# EAGLE design IRComputer (EAGLE 7.3.0)
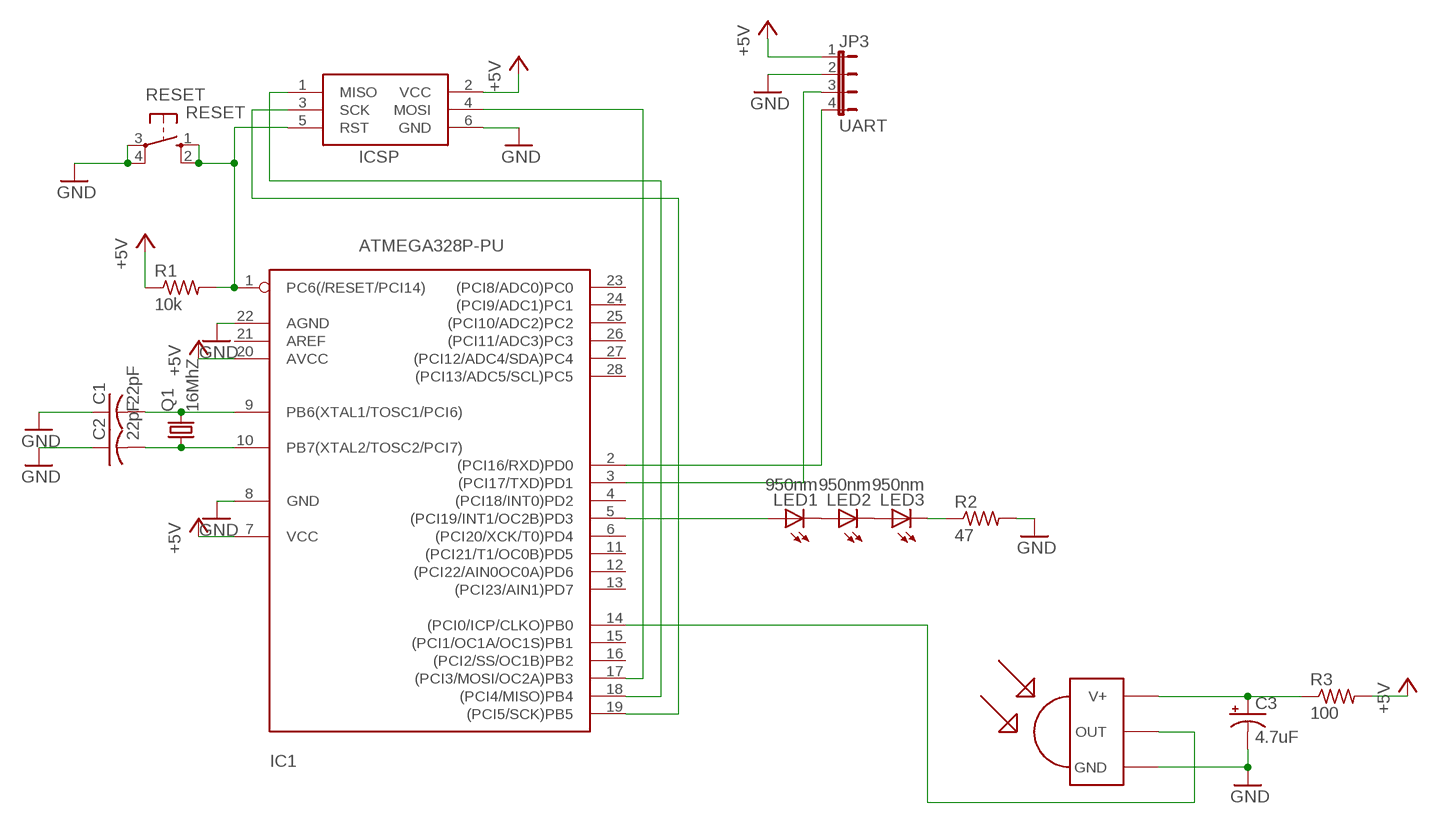
[diagram p0: schematic, sheet 1]

## Parts
C1  22pF  C-US025-024X044  [C025-024X044]
C2  22pF  C-US025-024X044  [C025-024X044]
C3  4.7uF  CPOL-USE1.8-4  [E1,8-4]
IC1  ATMEGA328P-PU  ATMEGA168-20P  [DIL28-3]
ICSP  AVRISP-6  [AVRISP]
JP3  UART  JP4E  [JP4]
LED1  950nm  LED5MM  [LED5MM]
LED2  950nm  LED5MM  [LED5MM]
LED3  950nm  LED5MM  [LED5MM]
Q1  16MhZ  CRYSTALHC49S  [HC49/S]
R1  10k  R-US_0204/7  [0204/7]
R2  47  R-US_0204/7  [0204/7]
R3  100  R-US_0204/7  [0204/7]
RESET  RESET  10-XX  [B3F-10XX]
U$1  TSOP1838  [TSOP18XX]

## Nets
+5V: IC1.7(VCC) IC1.20(AVCC) ICSP.2(VCC) JP3.1 R1.1 R3.2
GND [Ground]: C1.1 C2.1 C3.- IC1.8(GND) IC1.22(AGND) ICSP.6(GND) JP3.2 R2.2 RESET.3(P) RESET.4(P1) U$1.GND
N$1 [Oscillator]: C1.2 IC1.9(PB6(XTAL1/TOSC1/PCI6)) Q1.2
N$2 [Oscillator]: C2.2 IC1.10(PB7(XTAL2/TOSC2/PCI7)) Q1.1
N$3: IC1.14((PCI0/ICP/CLKO)PB0) U$1.OUT
N$4: C3.+ R3.1 U$1.VCC(V+)
N$5: IC1.3((PCI17/TXD)PD1) JP3.3
N$6: IC1.2((PCI16/RXD)PD0) JP3.4
N$7: IC1.5((PCI19/INT1/OC2B)PD3) LED1.A
N$8: IC1.17((PCI3/MOSI/OC2A)PB3) ICSP.4(MOSI)
N$9: IC1.18((PCI4/MISO)PB4) ICSP.1(MISO)
N$10: IC1.19((PCI5/SCK)PB5) ICSP.3(SCK)
N$11: LED2.K(C) LED3.A
N$12: LED3.K(C) R2.1
N$13: LED1.K(C) LED2.A
N$15: IC1.1(PC6(/RESET/PCI14)) ICSP.5(RST) R1.2 RESET.1(S) RESET.2(S1)
Unconnected: IC1.4((PCI18/INT0)PD2) IC1.6((PCI20/XCK/T0)PD4) IC1.11((PCI21/T1/OC0B)PD5) IC1.12((PCI22/AIN0OC0A)PD6) IC1.13((PCI23/AIN1)PD7) IC1.15((PCI1/OC1A/OC1S)PB1) IC1.16((PCI2/SS/OC1B)PB2) IC1.21(AREF) IC1.23((PCI8/ADC0)PC0) IC1.24((PCI9/ADC1)PC1) IC1.25((PCI10/ADC2)PC2) IC1.26((PCI11/ADC3)PC3) IC1.27((PCI12/ADC4/SDA)PC4) IC1.28((PCI13/ADC5/SCL)PC5)

## Library data of the parts
C1 C2 = adafruit:C-US: CAPACITOR, American symbol
C3 = adafruit:CPOL-US: POLARIZED CAPACITOR, American symbol
IC1 = adafruit:ATMEGA168*P: MICROCONTROLLER 16 kBytes FLASH 1 kBytes SRAM 512 Bytes EEPROM USART 8-channel 10 bit ADC
ICSP = adafruit:AVRISP: AVR ISP HEADER Standard 6 pin header for AVR programming
JP3 = jumper:JP4E: JUMPER
LED1-LED3 = adafruit:LED: LED OSRAM: - CHIPLED LG R971, LG N971, LY N971, LG Q971, LY Q971, LO R971, LY R971 LH N974, LH R974 LS Q976, LO Q976, LY Q976 LO Q996 - Hyper CHIPLED LW Q18S LB Q993, LB Q99A, LB R99A - SideLED LS A670, LO A670, LY A670, LG A670, LP A670 LB A673, LV A673, LT A673, LW A673 LH A674 LY A675 LS A676, LA A676, LO A676, LY A676, LW A676 LS A679, LY A679, LG A679 - Hyper Micro SIDELED® LS Y876, LA Y876, LO Y876, LY Y876 LT Y87S - SmartLED LW L88C, LW L88S LB L89C, LB L89S, LG L890 LS L89K, LO L89K, LY L89K LS L896, LA L896, LO L896, LY L896 - TOPLED LS T670, LO T670, LY T670, LG T670, LP T670 LSG T670, LSP T670, LSY T670, LOP T670, LYG T670 LG T671, LOG T671, LSG T671 LB T673, LV T673, LT T673, LW T673 LH T674 LS T676, LA T676, LO T676, LY T676, LB T676, LH T676, LSB T676, LW T676 LB T67C, LV T67C, LT T67C, LS T67K, LO T67K, LY T67K, LW E67C LS E67B, LA E67B, LO E67B, LY E67B, LB E67C, LV E67C, LT E67C LW T67C LS T679, LY T679, LG T679 LS T770, LO T770, LY T770, LG T770, LP T770 LB T773, LV T773, LT T773, LW T773 LH T774 LS E675, LA E675, LY E675, LS T675 LS T776, LA T776, LO T776, LY T776, LB T776 LHGB T686 LT T68C, LB T68C - Hyper Mini TOPLED® LB M676 - Mini TOPLED Santana® LG M470 LS M47K, LO M47K, LY M47K Source: http://www.osram.convergy.de/
Q1 = adafruit:CRYSTAL: CRYSTAL; OC_FARNELL: 1667008; OC_NEWARK: unknown
R1-R3 = adafruit:R-US_: RESISTOR, American symbol
RESET = switch-omron:10-XX: OMRON SWITCH; MPN: B3F-1000; OC_FARNELL: 176432; OC_NEWARK: 36M3542
U$1 = tsop:TSOP1838: IR Receiver and Demodulator

## Net classes
0 default: width 0.508 mm, drill 0.508 mm, clearance 0.152 mm
1 Oscillator: width 0.508 mm, drill 0.508 mm, clearance 0.152 mm
2 Ground: width 0.508 mm, drill 0.508 mm, clearance 0.254 mm

## Board
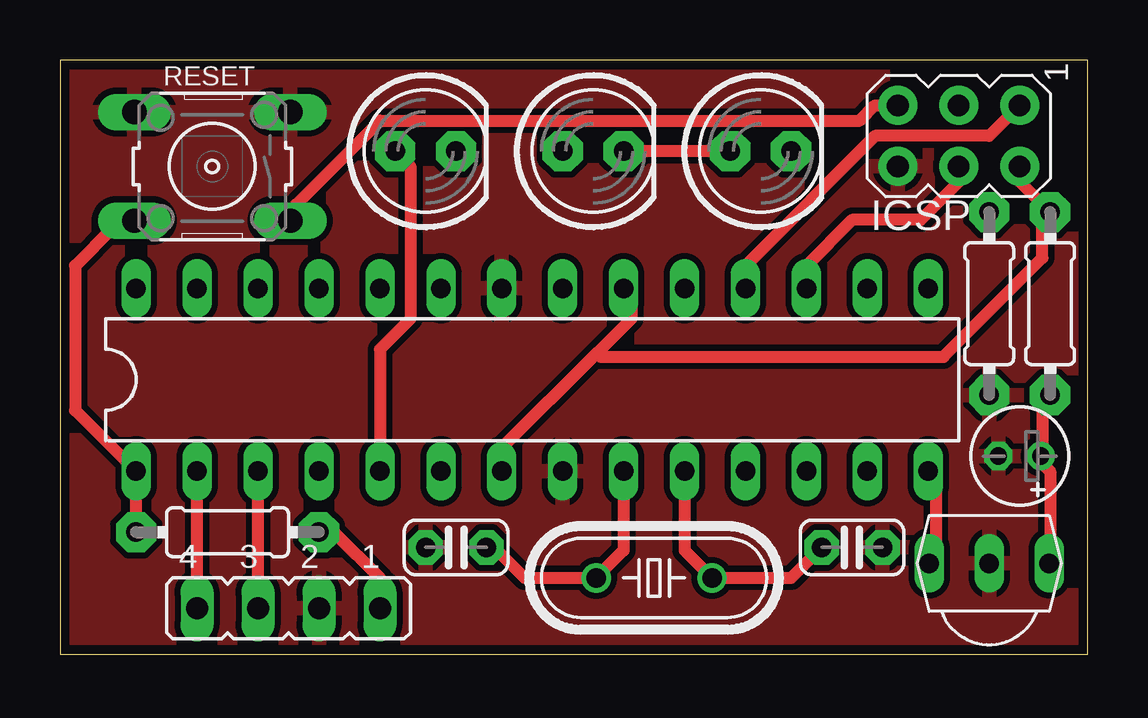
[diagram p1: board, top side]
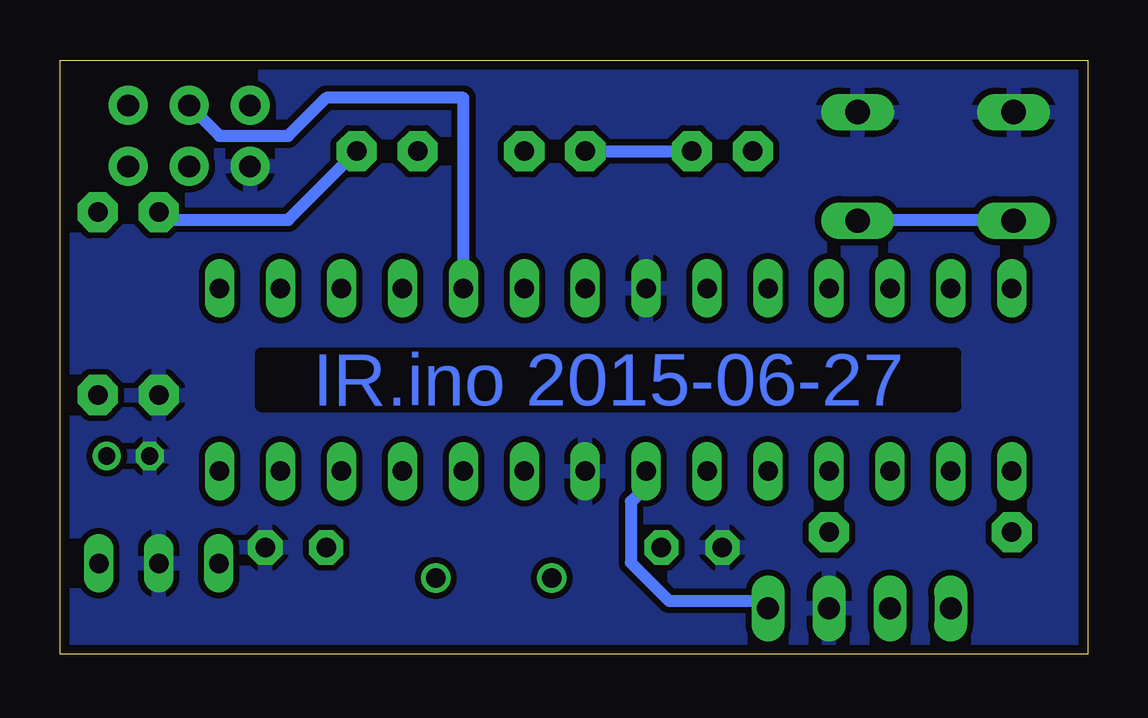
[diagram p2: board, bottom side, seen from below]

Size 42.85 x 24.75 mm. Coordinates in mm from the lower left corner, seen from the top.
Outline: 0,0 42.85,0 42.85,24.75 0,24.75 0,0
Copper layers (1*16): Top 0.0356mm / dielectric 1.5011mm / Bottom 0.0356mm
Design rules "oshpark": minimum track width 6mil, minimum drill 13mil, track to track 6mil, track to pad 6mil, pad to pad 6mil, via to via 6mil, smd to smd 6mil, copper to edge 15mil, drill to drill 6mil, minimum pad ring 7mil, minimum via ring 7mil, stop-mask expansion 3mil, vias tented up to drill 0mil, thermal gap 10mil

### Footprints (pad centres in the part's own frame; a part is rotated, then mirrored left to right if it is on the bottom)
C025-024X044 = drill 0.813 pad 1.422 octagon: 1 -1.27,0; 2 1.27,0
E1,8-4 = drill 0.711 pad 1.168: + -0.889,0 | drill 0.711 pad 1.168 octagon: - 0.889,0
DIL28-3 = drill 0.813 long: 1 -16.51,-3.81; 2 -13.97,-3.81; 3 -11.43,-3.81; 4 -8.89,-3.81; 5 -6.35,-3.81; 6 -3.81,-3.81; 7 -1.27,-3.81; 8 1.27,-3.81; 9 3.81,-3.81; 10 6.35,-3.81; 11 8.89,-3.81; 12 11.43,-3.81; 13 13.97,-3.81; 14 16.51,-3.81; 15 16.51,3.81; 16 13.97,3.81; 17 11.43,3.81; 18 8.89,3.81; 19 6.35,3.81; 20 3.81,3.81; 21 1.27,3.81; 22 -1.27,3.81; 23 -3.81,3.81; 24 -6.35,3.81; 25 -8.89,3.81; 26 -11.43,3.81; 27 -13.97,3.81; 28 -16.51,3.81
AVRISP = drill 0.9 pad 1.626: 1 -1.27,2.54; 2 1.27,2.54; 3 -1.27,0; 4 1.27,0; 5 -1.27,-2.54; 6 1.27,-2.54
JP4 = drill 0.914 long: 1 -3.81,0; 2 -1.27,0; 3 1.27,0; 4 3.81,0
LED5MM = drill 0.813 pad 1.676 octagon: A -1.27,0; K 1.27,0
HC49/S = drill 0.813: 1 -2.413,0; 2 2.413,0
0204/7 = drill 0.813 pad 1.676 octagon: 1 -3.81,0; 2 3.81,0
B3F-10XX = drill 1.016 long: 1 -3.251,2.261; 2 3.251,2.261; 3 -3.251,-2.261; 4 3.251,-2.261
TSOP18XX = drill 0.813 long: GND -0.001,-0.027; OUT -2.501,-0.027; VCC 2.499,-0.027

### Placement (x,y rotation side)
C1  16.51,4.45 0 top
C2  33.02,4.45 180 top
C3  40.01,8.26 180 top
IC1  19.68,11.43 0 top
ICSP  37.47,21.59 270 top
JP3  9.53,1.91 180 top
LED1  15.24,20.95 0 top
LED2  22.23,20.95 0 top
LED3  29.21,20.95 0 top
Q1  24.77,3.17 180 top
R1  6.99,5.08 180 top
R2  38.73,14.61 270 top
R3  41.27,14.61 90 top
RESET  6.35,20.32 180 top
U$1  38.73,3.81 0 top

### Tracks (layer width: path | path; a pad name or v marks a point on that pad's centre or on a via)
+5V
  Top 0.508: JP3.1 13.34,3.17 11.43,5.08 R1.1 | ICSP.2 40.01,19.68 R3.2 40.96,18.41 40.96,16.51 36.83,12.38 22.54,12.38 22.38,12.54 | IC1.7 18.41,8.57 22.38,12.54 | 22.38,12.54 23.81,13.97 23.81,14.92 IC1.20
  Bottom 0.508: JP3.1 13.65,2.22 17.46,2.22 19.05,3.81 19.05,6.35 18.41,6.99 IC1.7
GND
  pour Top: -1.27,25.4 -1.27,-1.27 44.45,-1.27 44.45,25.4
  pour Bottom: -2.54,26.67 -2.54,-2.54 45.72,-2.54 45.72,26.67
N$1
  Top 0.508: C1.2 18.1,4.45 19.37,3.17 Q1.2 23.5,4.32 IC1.9
N$2
  Top 0.508: IC1.10 26.04,4.32 Q1.1 30.48,3.17 C2.2
N$3
  Top 0.508: IC1.14 36.51,7.3 36.51,3.81 U$1.OUT
N$4
  Top 0.508: R3.1 40.96,10.48 40.96,8.26 C3.+ 40.64,8.26 41.27,7.62 41.27,3.81 U$1.VCC
N$5
  Top 0.508: JP3.3 IC1.3
N$6
  Top 0.508: JP3.4 IC1.2
N$7
  Top 0.508: IC1.5 13.34,12.7 14.61,13.97 14.61,20.32 LED1.A
N$8
  Top 0.508: IC1.17 31.11,16.19 33.02,18.1 35.88,18.1 37.47,19.68 ICSP.4
N$9
  Top 0.508: IC1.18 28.57,16.19 33.97,21.59 38.73,21.59 ICSP.1
N$10
  Bottom 0.508: ICSP.3 36.2,21.59 33.34,21.59 31.75,23.18 26.04,23.18 IC1.19
N$11
  Top 0.508: LED3.A LED2.K
N$12
  Bottom 0.508: LED3.K 33.34,18.1 38.42,18.1 R2.1
N$13
  Bottom 0.508: LED2.A LED1.K
N$15
  Top 0.508: R1.2 IC1.1 0.64,10.16 0.64,16.19 2.22,17.78 2.86,17.78 RESET.2 | RESET.1 9.84,18.1 9.84,18.73 13.34,22.23 33.34,22.23 33.97,22.86 ICSP.5
  Bottom 0.508: RESET.2 3.17,18.1 9.53,18.1 RESET.1

### Text on the board
Bottom: IR.ino 2015-06-27
bStop: IR.ino 2015-06-27